# EAGLE design USB_FTDI_Prog_Pwr (EAGLE 7.3.0)
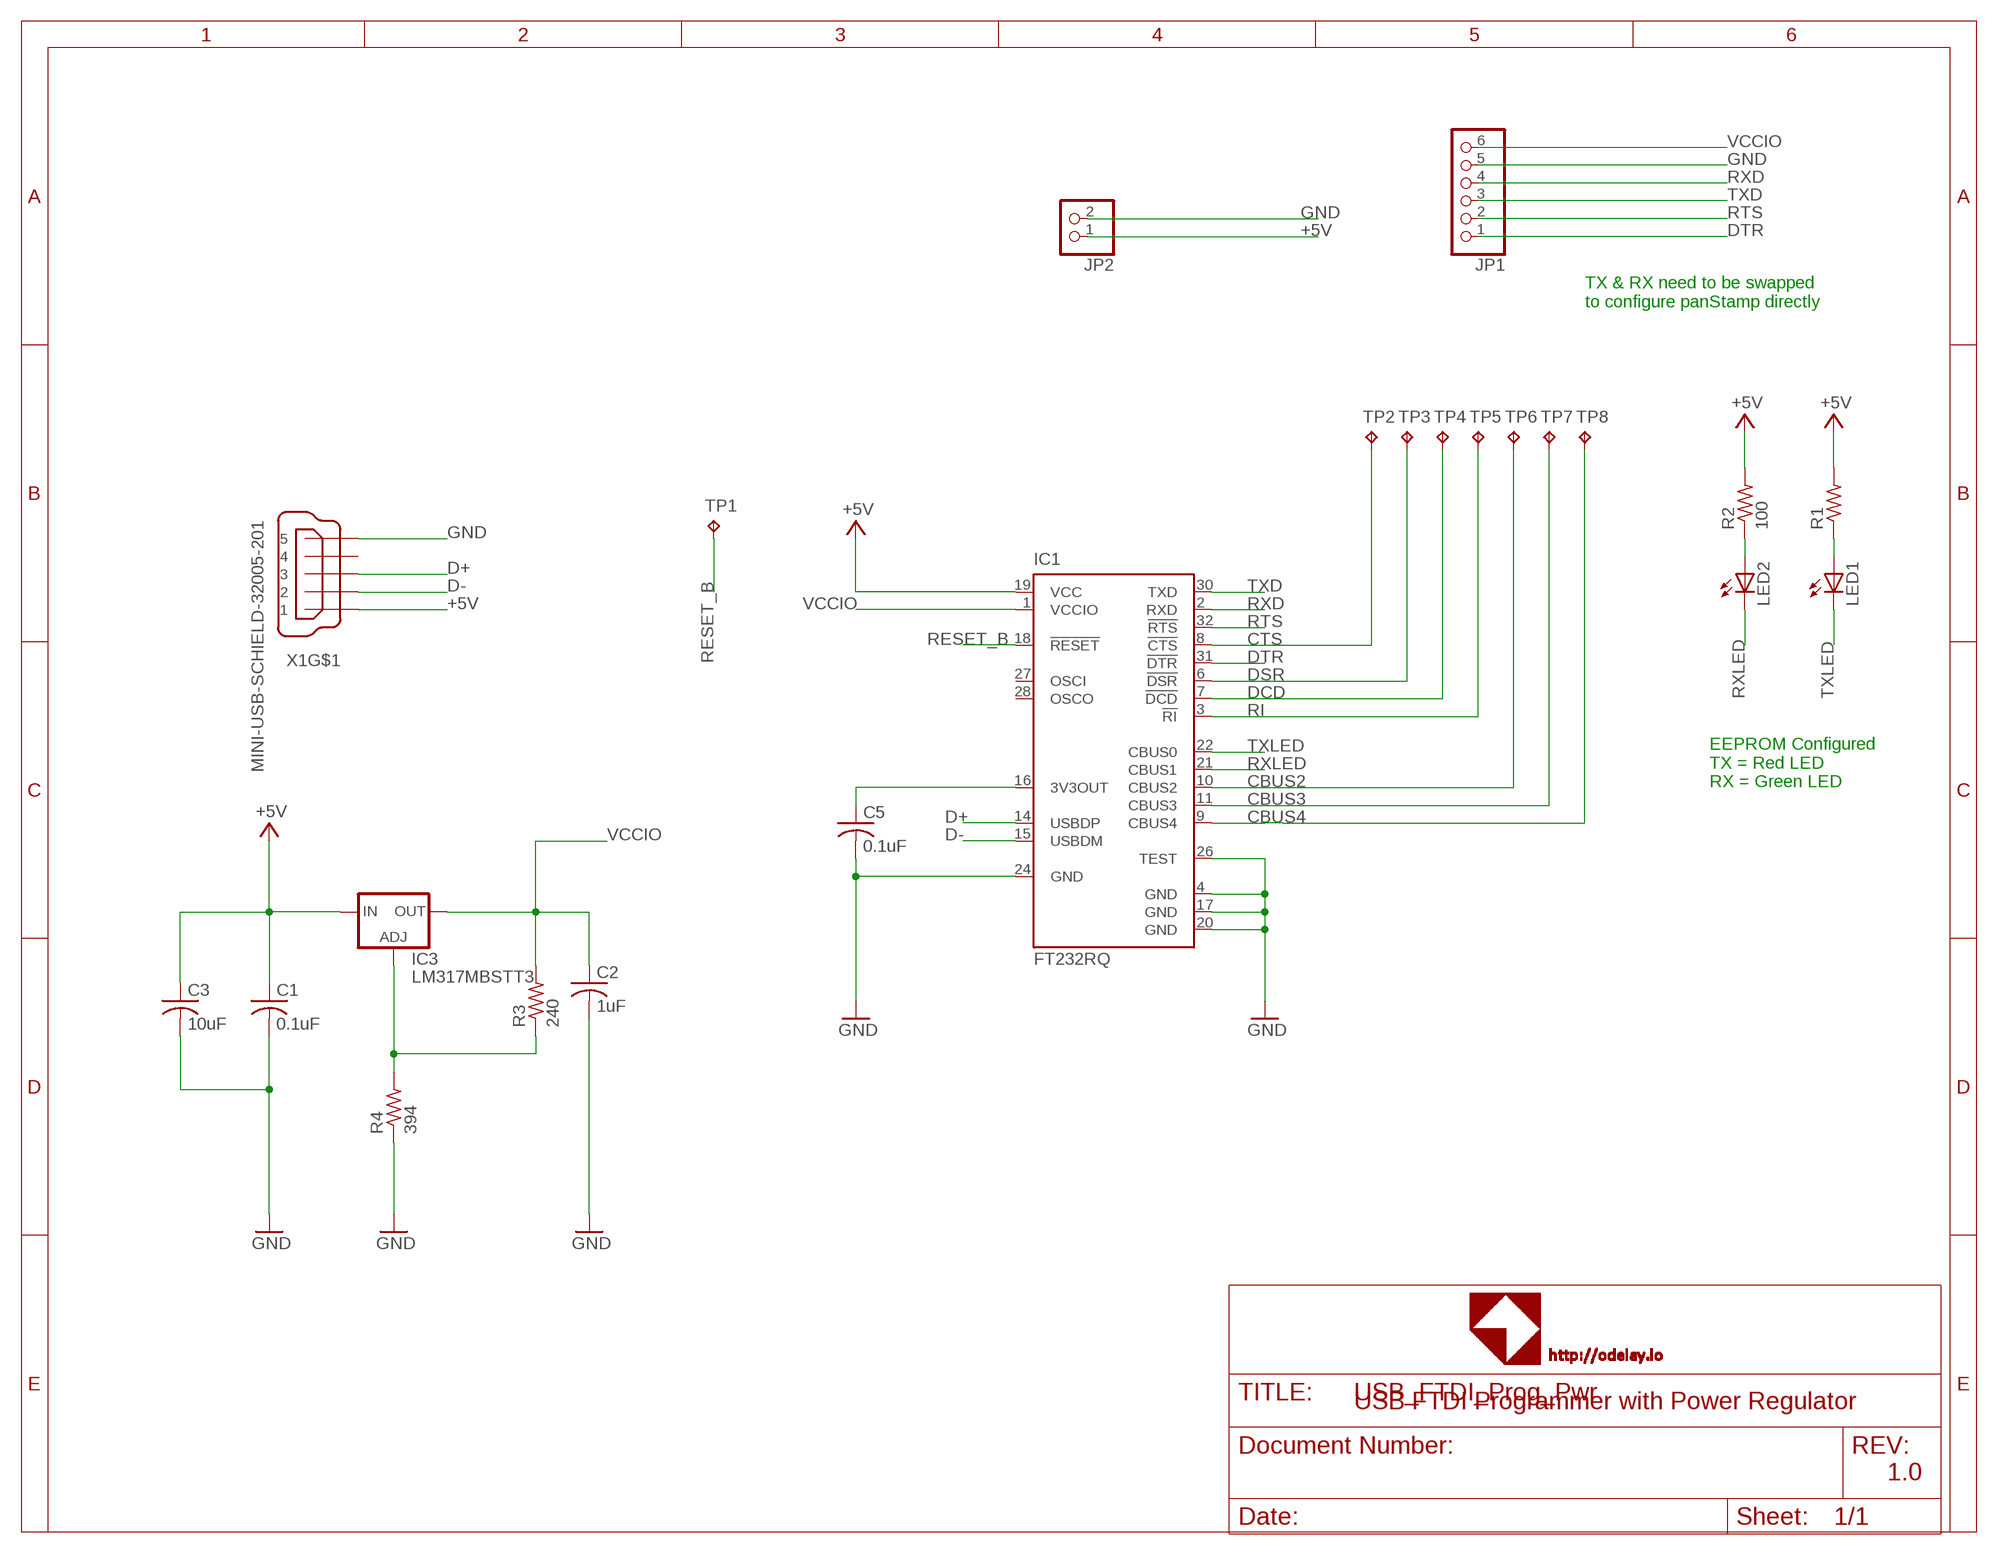
[diagram p0: schematic, sheet 1]

## Parts
C1  0.1uF  C-USC0402  [C0402]
C2  1uF  C-USC0402  [C0402]
C3  10uF  C-USC0603  [C0603]
C5  0.1uF  C-USC0402  [C0402]
IC1  FT232RQ  [QFN32]
IC3  LM317MBSTT3  [SOT223]
JP1  PINHD-1X6  [1X06]
JP2  PINHD-1X2  [1X02]
LED1  LEDCHIP-LED0603  [CHIP-LED0603]
LED2  LEDCHIP-LED0603  [CHIP-LED0603]
R1  R-US_R0402  [R0402]
R2  100  R-US_R0402  [R0402]
R3  240  R-US_R0402  [R0402]
R4  394  R-US_R0402  [R0402]
TP1  TPB1,27  [B1,27]
TP2  TPB1,27  [B1,27]
TP3  TPB1,27  [B1,27]
TP4  TPB1,27  [B1,27]
TP5  TPB1,27  [B1,27]
TP6  TPB1,27  [B1,27]
TP7  TPB1,27  [B1,27]
TP8  TPB1,27  [B1,27]
X1  MINI-USB-SCHIELD-32005-201  [32005-201]

## Nets
+5V: C1.1 C3.1 IC1.19(VCC) IC3.3(IN) JP2.1 R1.2 R2.2 X1.1
CBUS2: IC1.10(CBUS2) TP6.TP
CBUS3: IC1.11(CBUS3) TP7.TP
CBUS4: IC1.9(CBUS4) TP8.TP
CTS: IC1.8(!CTS) TP2.TP
D+: IC1.14(USBDP) X1.3
D-: IC1.15(USBDM) X1.2
DCD: IC1.7(!DCD) TP4.TP
DSR: IC1.6(!DSR) TP3.TP
DTR: IC1.31(!DTR) JP1.1
GND: C1.2 C2.2 C3.2 C5.2 IC1.4(GND) IC1.17(GND) IC1.20(GND) IC1.24(GND) IC1.26(TEST) JP1.5 JP2.2 R4.1 X1.5
N$1: LED1.A R1.1
N$2: IC3.1(ADJ) R3.1 R4.2
N$4: C5.1 IC1.16(3V3OUT)
N$5: LED2.A R2.1
RESET_B: IC1.18(!RESET) TP1.TP
RI: IC1.3(!RI) TP5.TP
RTS: IC1.32(!RTS) JP1.2
RXD: IC1.2(RXD) JP1.4
RXLED: IC1.21(CBUS1) LED2.C
TXD: IC1.30(TXD) JP1.3
TXLED: IC1.22(CBUS0) LED1.C
VCCIO: C2.1 IC1.1(VCCIO) IC3.4(OUT) JP1.6 R3.2
Unconnected: IC1.27(OSCI) IC1.28(OSCO) X1.4 X1.M1(S:S1) X1.M2(S:S2) X1.M3(S:S3) X1.M4(S:S4)

## Notes on the sheet
- TX & RX need to be swapped
  to configure panStamp directly
- EEPROM Configured
  TX = Red LED
  RX = Green LED
- USB FTDI Programmer with Power Regulator
- 1.0

## Library data of the parts
C1-C3 C5 = rcl:C-US: CAPACITOR, American symbol
IC1 = ftdichip:FT232R: Source: http://www.ftdichip.com/Documents/DataSheets/DS_FT232R_v104.pdf; MPN: FT232RQ; OC_FARNELL: 1146033; OC_NEWARK: 91K9919
IC3 = v-reg:LM317?*: 500 mA Adjustable Output Positive Voltage Regulator Source: http://www.onsemi.co.jp .. LM317M-D.PDF
JP1 = pinhead:PINHD-1X6: PIN HEADER
JP2 = pinhead:PINHD-1X2: PIN HEADER
LED1 LED2 = led:LED: LED OSRAM: - CHIPLED LG R971, LG N971, LY N971, LG Q971, LY Q971, LO R971, LY R971 LH N974, LH R974 LS Q976, LO Q976, LY Q976 LO Q996 - Hyper CHIPLED LW Q18S LB Q993, LB Q99A, LB R99A - SideLED LS A670, LO A670, LY A670, LG A670, LP A670 LB A673, LV A673, LT A673, LW A673 LH A674 LY A675 LS A676, LA A676, LO A676, LY A676, LW A676 LS A679, LY A679, LG A679 - Hyper Micro SIDELED® LS Y876, LA Y876, LO Y876, LY Y876 LT Y87S - SmartLED LW L88C, LW L88S LB L89C, LB L89S, LG L890 LS L89K, LO L89K, LY L89K LS L896, LA L896, LO L896, LY L896 - TOPLED LS T670, LO T670, LY T670, LG T670, LP T670 LSG T670, LSP T670, LSY T670, LOP T670, LYG T670 LG T671, LOG T671, LSG T671 LB T673, LV T673, LT T673, LW T673 LH T674 LS T676, LA T676, LO T676, LY T676, LB T676, LH T676, LSB T676, LW T676 LB T67C, LV T67C, LT T67C, LS T67K, LO T67K, LY T67K, LW E67C LS E67B, LA E67B, LO E67B, LY E67B, LB E67C, LV E67C, LT E67C LW T67C LS T679, LY T679, LG T679 LS T770, LO T770, LY T770, LG T770, LP T770 LB T773, LV T773, LT T773, LW T773 LH T774 LS E675, LA E675, LY E675, LS T675 LS T776, LA T776, LO T776, LY T776, LB T776 LHGB T686 LT T68C, LB T68C - Hyper Mini TOPLED® LB M676 - Mini TOPLED Santana® LG M470 LS M47K, LO M47K, LY M47K Source: http://www.osram.convergy.de LUXEON: - LUMILED® LXK2-PW12-R00, LXK2-PW12-S00, LXK2-PW14-U00, LXK2-PW14-V00 LXK2-PM12-R00, LXK2-PM12-S00, LXK2-PM14-U00 LXK2-PE12-Q00, LXK2-PE12-R00, LXK2-PE12-S00, LXK2-PE14-T00, LXK2-PE14-U00 LXK2-PB12-K00, LXK2-PB12-L00, LXK2-PB12-M00, LXK2-PB14-N00, LXK2-PB14-P00, LXK2-PB14-Q00 LXK2-PR12-L00, LXK2-PR12-M00, LXK2-PR14-Q00, LXK2-PR14-R00 LXK2-PD12-Q00, LXK2-PD12-R00, LXK2-PD12-S00 LXK2-PH12-R00, LXK2-PH12-S00 LXK2-PL12-P00, LXK2-PL12-Q00, LXK2-PL12-R00 Source: www.luxeon.com KINGBRIGHT: KA-3528ASYC Source: www.kingbright.com
R1-R4 = resistor:R-US_: RESISTOR, American symbol
TP1-TP8 = testpad:TP: Test pad
X1 = con-cypressindustries:MINI-USB-SCHIELD-: MINI USB-B Conector Source: www.cypressindustries.com; OC_FARNELL: unknown; OC_NEWARK: unknown

## Board
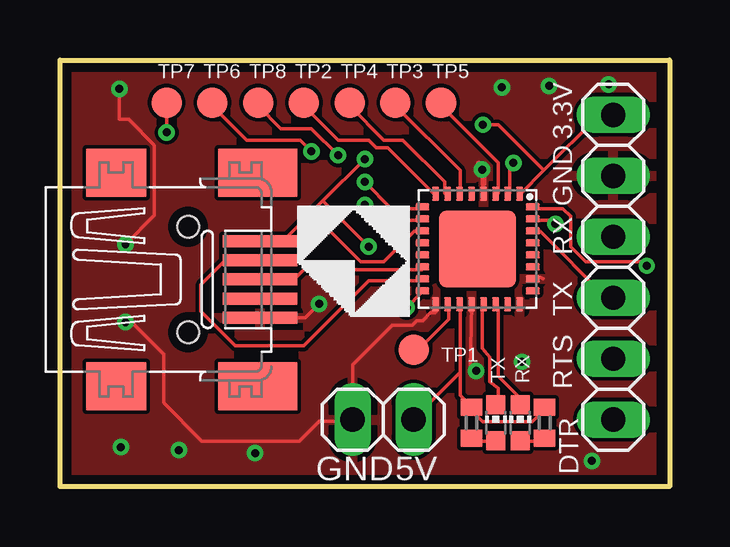
[diagram p1: board, top side]
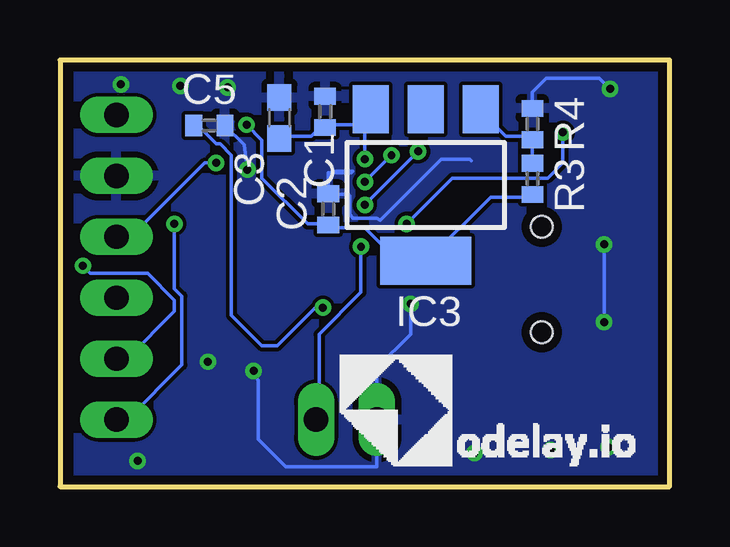
[diagram p2: board, bottom side, seen from below]

Size 25.4 x 17.78 mm. Coordinates in mm from the lower left corner, seen from the top.
Outline: 0,0 0,17.78 25.4,17.78 25.4,0 0,0
Copper layers (1*16): Top 0.0356mm / dielectric 1.5011mm / Bottom 0.0356mm
Design rules "oshpark-2layer": minimum track width 6mil, minimum drill 13mil, track to track 6mil, track to pad 6mil, pad to pad 6mil, via to via 6mil, smd to smd 6mil, copper to edge 15mil, drill to drill 6mil, minimum pad ring 7mil, minimum via ring 7mil, stop-mask expansion 2.5mil, vias tented up to drill 0mil, thermal gap 10mil

### Footprints (pad centres in the part's own frame; a part is rotated, then mirrored left to right if it is on the bottom)
C0402 = smd 0.7 x 0.9: 1 -0.65,0; 2 0.65,0
C0603 = smd 1.1 x 1: 1 -0.85,0; 2 0.85,0
QFN32 = smd 0.6 x 0.3: 1 -2.3,1.75; 2 -2.3,1.25; 3 -2.3,0.75; 4 -2.3,0.25; 5 -2.3,-0.25; 6 -2.3,-0.75; 7 -2.3,-1.25; 8 -2.3,-1.75; 17 2.3,-1.75; 18 2.3,-1.25; 19 2.3,-0.75; 20 2.3,-0.25; 21 2.3,0.25; 22 2.3,0.75; 23 2.3,1.25; 24 2.3,1.75 | smd 0.3 x 0.6: 9 -1.75,-2.3; 10 -1.25,-2.3; 11 -0.75,-2.3; 12 -0.25,-2.3; 13 0.25,-2.3; 14 0.75,-2.3; 15 1.25,-2.3; 16 1.75,-2.3; 25 1.75,2.3; 26 1.25,2.3; 27 0.75,2.3; 28 0.25,2.3; 29 -0.25,2.3; 30 -0.75,2.3; 31 -1.25,2.3; 32 -1.75,2.3 | smd 3.2 x 3.2: EXP 0,0
SOT223 = smd 1.5 x 2: 1 -2.3,-3.15; 2 0,-3.15; 3 2.3,-3.15 | smd 3.8 x 2: 4 0,3.15
1X06 = drill 1.016 long: 1 -6.35,0; 2 -3.81,0; 3 -1.27,0; 4 1.27,0; 5 3.81,0; 6 6.35,0
1X02 = drill 1.016 long: 1 -1.27,0; 2 1.27,0
CHIP-LED0603 = smd 0.8 x 0.8: A 0,-0.75; C 0,0.75
R0402 = smd 0.7 x 0.9: 1 -0.65,0; 2 0.65,0
B1,27 = smd 1.27 x 1.27: TP 0,0
32005-201 = smd 3.1 x 0.5: 1 3,1.6; 2 3,0.8; 3 3,0; 4 3,-0.8; 5 3,-1.6 | smd 2.5 x 2: M1 -3,-4.45; M2 -3,4.45 | smd 3.3 x 2: M3 2.9,4.45; M4 2.9,-4.45 | hole 0.9: 0,2.2; 0,-2.2

### Placement (x,y rotation side)
C1  14.35,15.62 90 bottom
C2  14.22,11.56 90 bottom
C3  16.26,15.37 90 bottom
C5  19.18,15.05 0 bottom
IC1  17.4,9.91 270 top
IC3  10.16,12.57 180 bottom
JP1  23.05,9.14 90 top
JP2  13.46,2.79 180 top
LED1  19.18,2.67 0 top
LED2  18.16,2.67 0 top
R1  20.19,2.67 90 top
R2  17.14,2.67 90 top
R3  5.71,12.83 270 bottom
R4  5.71,15.11 270 bottom
TP1  14.73,5.71 0 top
TP2  10.16,16 0 top
TP3  13.97,16 0 top
TP4  12.06,16 0 top
TP5  15.88,16 0 top
TP6  6.35,16 0 top
TP7  4.45,16 0 top
TP8  8.26,16 0 top
X1  5.33,8.64 0 top

### Tracks (layer width: path | path; a pad name or v marks a point on that pad's centre or on a via)
+5V  (via drill 0.33)
  Top 0.152: 16.67,4.76 16.67,3.81 17.14,3.33 R2.2 17.14,3.17 17.62,2.7 19.68,2.7 20.16,3.17 R1.2 | 16.67,4.76 16.67,7.46 IC1.19 | 16.67,4.76 14.76,2.86 JP2.1 | v12.7,13.65 10.95,11.91 | 10.95,11.91 9.37,10.32 8.41,10.32 X1.1 | 10.95,11.91 v12.86,10
  Bottom 0.152: 12.7,15.56 12.54,15.72 IC3.3 12.7,15.56 | 12.7,15.56 13.18,15.08 14.29,15.08 C1.1 14.45,15.08 14.92,14.61 16.19,14.61 C3.1 | 12.7,15.56 v12.7,13.65 | v12.86,10 12.86,8.1 14.61,6.35 14.61,2.86 JP2.1
CBUS2  (via drill 0.33)
  Top 0.152: v12.7,11.75 13.34,11.11 15.08,11.11 IC1.10 | v10.48,13.97 10,14.45 7.78,14.45 6.35,15.88 TP6.TP
  Bottom 0.152: v10.48,13.97 v12.7,11.75
CBUS3  (via drill 0.33)
  Top 0.152: v10.95,10.95 12.54,9.37 13.49,9.37 14.76,10.64 15.08,10.64 IC1.11 | TP7.TP v4.45,14.76
  Bottom 0.152: v10.95,10.95 9.05,12.86 5.08,12.86 4.45,13.49 v4.45,14.76
CBUS4  (via drill 0.33)
  Top 0.152: v12.7,12.7 13.81,11.59 15.08,11.59 IC1.9 | v11.59,13.81 10.48,14.92 9.21,14.92 8.26,15.88 TP8.TP
  Bottom 0.152: v11.59,13.81 v12.7,12.7
CTS
  Top 0.152: IC1.8 15.56,12.22 13.65,14.13 13.18,14.13 12.86,14.45 11.59,14.45 10.16,15.88 TP2.TP
D+
  Top 0.152: IC1.14 15.08,9.05 10.16,9.05 9.84,8.73 8.41,8.73 X1.3
D-
  Top 0.152: IC1.15 15.08,8.57 12.86,8.57 10.16,5.87 7.3,5.87 5.87,7.3 5.87,8.41 6.83,9.37 8.26,9.37 X1.2
DCD
  Top 0.152: IC1.7 16.03,12.22 16.03,12.7 14.29,14.45 13.49,14.45 12.06,15.88 TP4.TP
DSR
  Top 0.152: IC1.6 16.67,12.22 16.67,13.18 13.97,15.88 TP3.TP
DTR  (via drill 0.33)
  Top 0.152: v20.64,10.95 20.48,11.11 19.84,11.11 IC1.31
  Bottom 0.152: v20.64,10.95 20.64,8.26 20.32,7.94 20.32,5.08 22.54,2.86 23.02,2.86 JP1.1
GND  (via drill 0.33)
  Top 0.152: 17.15,7.18 17.14,7.3 17.14,7.46 IC1.20 17.09,4.89 v17.34,4.83 | IC1.26 19.84,8.73 20,8.73 20.13,8.66 | 17.62,12.54 17.62,12.22 IC1.4 | 17.62,12.54 17.65,12.63 | 17.62,12.54 17.62,13.11 v17.59,13.21 | IC1.17 15.65,7.27 15.62,7.24 15.43,7.24 15.11,6.92 14.86,6.92 14.67,6.73 13.84,6.73 12.19,5.08 JP2.2 | X1.5 10.21,7.04 v10.79,7.62 | v2.48,16.57 2.48,15.3 2.86,15.3 3.94,14.22 3.94,11.3 v2.73,10.1 | v2.73,6.86 2.98,6.86 4.32,5.52 4.32,3.49 5.91,1.91 9.97,1.91 10.79,2.73 12.26,2.73 12.32,2.79 12.26,2.86
  Top 0.254: 17.65,12.63 17.65,13.27 17.46,13.46
  Bottom 0.152: v17.59,13.21 17.72,14.24 C5.2 | v10.79,7.62 10.79,6.35 12.19,4.95 12.19,2.86 | 14.22,12.89 C2.2 14.22,12.19 13.4,12.19 13.34,12.13 13.34,11.37 13.21,11.18 12.19,11.18 12.06,11.11 9.53,13.65 8.32,13.65 8.26,13.59 | 14.22,12.89 14.22,13.08 13.27,13.08 13.21,13.14 13.97,13.14 14.22,12.89 | R4.1 5.71,16.45 5.14,17.02 2.92,17.02 v2.48,16.57 | v2.73,10.1 v2.73,6.86 | v17.34,4.83 17.21,4.51 17.14,4.45 17.14,1.97 16,0.83 12.19,0.83 JP2.2 12.19,2.86 | 12.26,2.92 12.19,2.86
  other vias: 2.54,1.65 4.95,1.52 8.13,1.4 18.41,16.64 20.38,16.7 22.86,16.76 22.16,1.08 19.24,5.21
  pour Top: 0.51,17.27 24.64,17.27 24.64,0.51 0.51,0.51
  pour Bottom: 0.51,17.27 24.64,17.27 24.64,0.51 0.51,0.51
N$1
  Top 0.152: LED1.A 19.21,1.91 20.16,1.91 R1.1
N$2
  Bottom 0.152: R3.1 R4.2 5.71,14.61 6.83,14.61 7.94,15.72 IC3.1
N$4  (via drill 0.33)
  Top 0.152: v14.45,7.46 15.08,8.1 IC1.16
  Bottom 0.152: v14.45,7.46 14.76,7.46 16.35,5.87 16.99,5.87 18.26,7.14 18.26,13.81 18.73,14.29 18.89,14.29 19.68,15.08 C5.1
N$5
  Top 0.152: LED2.A 18.1,1.91 17.14,1.91 R2.1
RESET_B
  Top 0.152: TP1.TP 14.92,5.71 16.19,6.99 16.19,7.46 IC1.18
RI
  Top 0.152: IC1.3 18.26,12.22 18.26,13.49 15.88,15.88 TP5.TP
RTS  (via drill 0.33)
  Top 0.152: v24.45,9.21 24.29,9.37 21.91,9.37 21.27,10 21.27,11.27 20.95,11.59 19.84,11.59 IC1.32
  Bottom 0.152: v24.45,9.21 24.13,8.89 21.75,8.89 20.64,7.78 20.64,7.3 22.54,5.4 23.02,5.4 JP1.2
RXD  (via drill 0.33)
  Top 0.152: v18.89,13.49 18.73,13.34 18.73,12.22 IC1.2
  Bottom 0.152: v18.89,13.49 19.37,13.49 22.38,10.48 23.02,10.48 JP1.4
RXLED
  Top 0.152: 17.62,7.46 IC1.21 17.59,7.55 17.59,5.78 17.91,5.4 17.91,4.38 18.26,4.1 18.26,3.49 LED2.C
TXD
  Top 0.152: IC1.30 19.84,10.64 20,10.64 22.7,7.94 23.02,7.94 JP1.3
TXLED
  Top 0.152: IC1.22 18.26,7.46 18.26,4.6 19.05,3.81 19.05,3.49 LED1.C
VCCIO  (via drill 0.33)
  Top 0.152: 20.16,13.18 22.38,15.4 23.02,15.4 JP1.6 | 20.16,13.18 19.21,12.22 IC1.1 | 20.16,13.18 18.26,15.08 v17.62,15.08
  Bottom 0.152: R3.2 5.71,12.06 7.46,12.06 10.16,9.37 IC3.4 10.16,9.53 11.43,9.53 12.7,10.79 14.13,10.79 C2.1 14.29,10.95 15.08,10.95 16.99,12.86 16.99,14.45 v17.62,15.08

### Text on the board
tNames: 3.3V | GND | RX | TX | TX | RX | RTS | DTR | GND | 5V